# Altium schematic sheet schematic.SchDoc
size A4; SheetNumber: 6; SheetTotal: 29
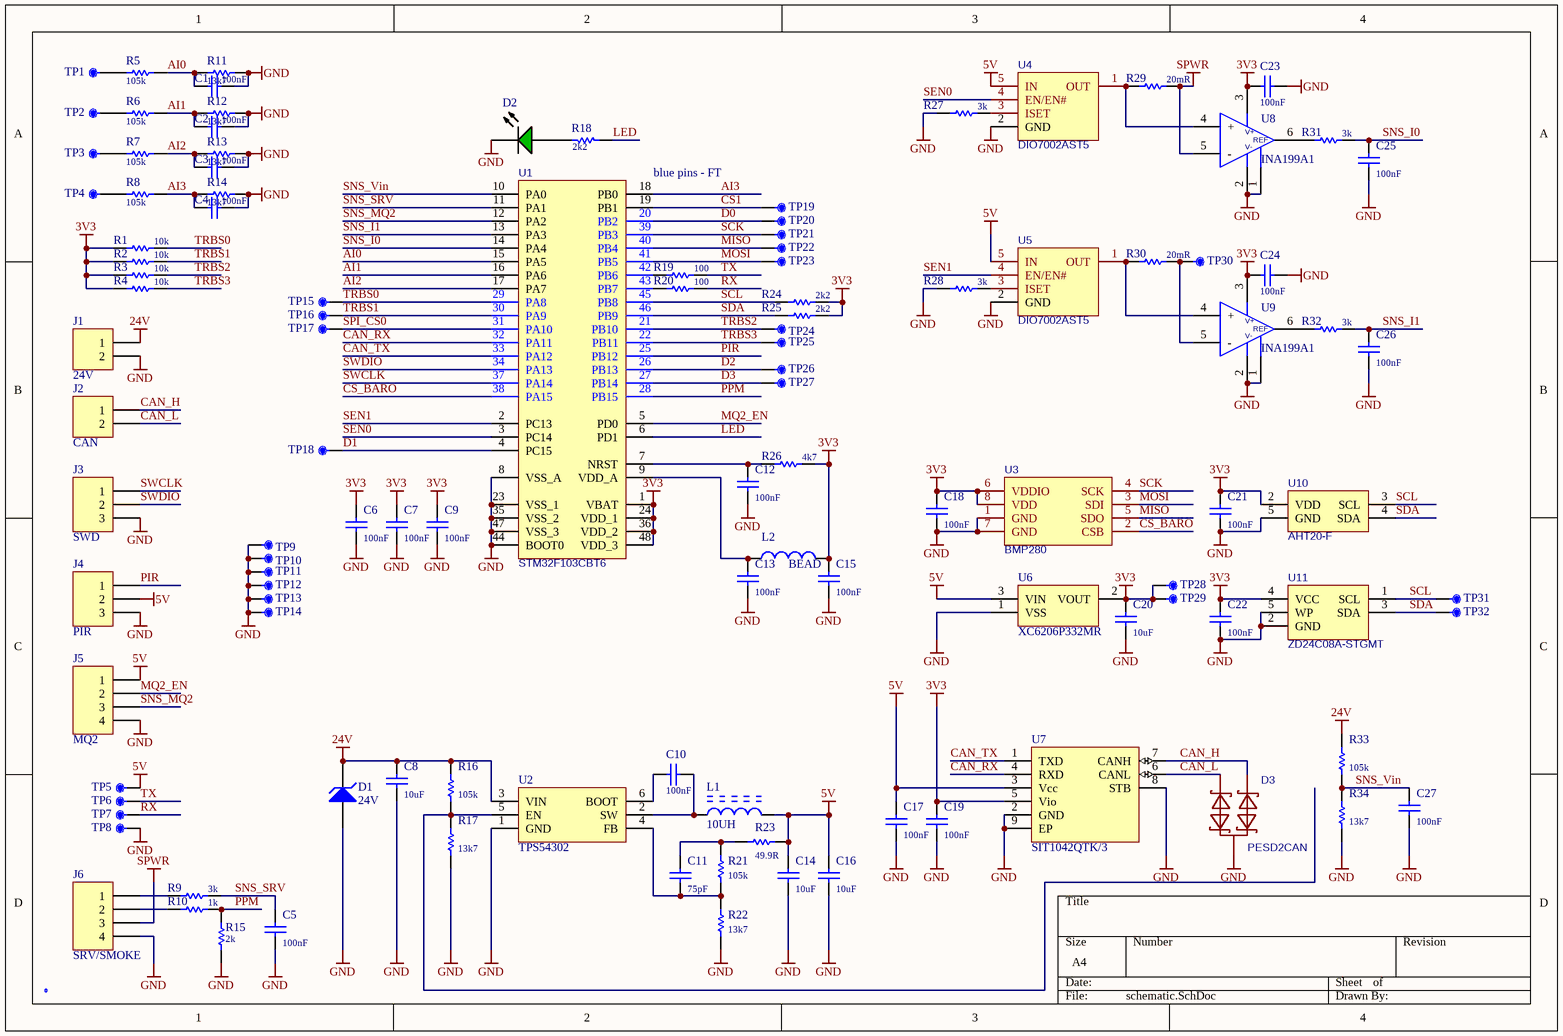
[diagram p0: schematic.SchDoc]

## Parts
C1  100nF  [C0402]
C2  100nF  [C0402]
C3  100nF  [C0402]
C4  100nF  [C0402]
C5  100nF  [C0402]
C6  100nF  [C0402]
C7  100nF  [C0402]
C8  10uF  [C1206]
C9  100nF  [C0402]
C10  100nF  [C0402]
C11  75pF  [C0402]
C12  100nF  [C0402]
C13  100nF  [C0402]
C14  10uF  [C1206]
C15  100nF  [C0402]
C16  10uF  [C1206]
C17  100nF  [C0402]
C18  100nF  [C0402]
C19  100nF  [C0402]
C20  10uF  [C1206]
C21  100nF  [C0402]
C22  100nF  [C0402]
C23  100nF  [C0402]
C24  100nF  [C0402]
C25  100nF  [C0402]
C26  100nF  [C0402]
C27  100nF  [C0402]
D1  24V  [SMB]
D2  GRN  [LED-0603-GRN]  (value not drawn)
D3  PESD2CAN  [SOT-23]
J1  24V  [CONN_DG308-2.54-2P]
J2  CAN  [CONN_DG308-2.54-2P]
J3  SWD  [SWD]  (no BOM)
J4  PIR  [CONN_MOLEX_532610371]  (no BOM)
J5  MQ2  [CONN_MOLEX_532610471]  (no BOM)
J6  SRV/SMOKE  [HDR-1X4]  (no BOM)
L1  10UH  [IND-SMD_L7.2-W6.6_GPSR07X0]
L2  BEAD  [L0402]
LOGO1  LOGO  [LOGO]  (value not drawn)  (no BOM)
R1  10k  [R0402]
R2  10k  [R0402]
R3  10k  [R0402]
R4  10k  [R0402]
R5  105k  [R0402]
R6  105k  [R0402]
R7  105k  [R0402]
R8  105k  [R0402]
R9  3k  [R0402]
R10  1k  [R0402]
R11  13k7  [R0402]
R12  13k7  [R0402]
R13  13k7  [R0402]
R14  13k7  [R0402]
R15  2k  [R0402]
R16  105k  [R0402]
R17  13k7  [R0402]
R18  2k2  [R0402]
R19  100  [R0402]
R20  100  [R0402]
R21  105k  [R0402]
R22  13k7  [R0402]
R23  49.9R  [R0402]
R24  2k2  [R0402]
R25  2k2  [R0402]
R26  4k7  [R0402]
R27  3k  [R0402]
R28  3k  [R0402]
R29  20mR  [R0805]
R30  20mR  [R0805]
R31  3k  [R0402]
R32  3k  [R0402]
R33  105k  [R0402]
R34  13k7  [R0402]
TP1  (no value)  [TP_TH_S0]  (no BOM)
TP2  (no value)  [TP_TH_S0]  (no BOM)
TP3  (no value)  [TP_TH_S0]  (no BOM)
TP4  (no value)  [TP_TH_S0]  (no BOM)
TP5  (no value)  [TP_TH_S0]  (no BOM)
TP6  (no value)  [TP_TH_S0]  (no BOM)
TP7  (no value)  [TP_TH_S0]  (no BOM)
TP8  (no value)  [TP_TH_S0]  (no BOM)
TP9  (no value)  [TP_TH_S0]  (no BOM)
TP10  (no value)  [TP_TH_S0]  (no BOM)
TP11  (no value)  [TP_TH_S0]  (no BOM)
TP12  (no value)  [TP_TH_S0]  (no BOM)
TP13  (no value)  [TP_TH_S0]  (no BOM)
TP14  (no value)  [TP_TH_S0]  (no BOM)
TP15  (no value)  [TP_TH_S0]  (no BOM)
TP16  (no value)  [TP_TH_S0]  (no BOM)
TP17  (no value)  [TP_TH_S0]  (no BOM)
TP18  (no value)  [TP_TH_S0]  (no BOM)
TP19  (no value)  [TP_TH_S0]  (no BOM)
TP20  (no value)  [TP_TH_S0]  (no BOM)
TP21  (no value)  [TP_TH_S0]  (no BOM)
TP22  (no value)  [TP_TH_S0]  (no BOM)
TP23  (no value)  [TP_TH_S0]  (no BOM)
TP24  (no value)  [TP_TH_S0]  (no BOM)
TP25  (no value)  [TP_TH_S0]  (no BOM)
TP26  (no value)  [TP_TH_S0]  (no BOM)
TP27  (no value)  [TP_TH_S0]  (no BOM)
TP28  (no value)  [TP_TH_S0]  (no BOM)
TP29  (no value)  [TP_TH_S0]  (no BOM)
TP30  (no value)  [TP_TH_S0]  (no BOM)
TP31  (no value)  [TP_TH_S0]  (no BOM)
TP32  (no value)  [TP_TH_S0]  (no BOM)
U1  STM32F103CBT6  [LQFP-48]
U2  TPS54302  [SOT-23-6]
U3  BMP280  [WLGA-8_L2.5-W2.0-P0.65-TR_DPS422]  (no BOM)
U4  DIO7002AST5  [SOT-23-5]
U5  DIO7002AST5  [SOT-23-5]
U6  XC6206P332MR  [SOT-23]
U7  SIT1042QTK/3  [DFN8_3X3_P065]
U8  INA199A1  [SOT-363]
U9  INA199A1  [SOT-363]  (no BOM)
U10  AHT20-F  [SENSOR-SMD_L3.0-W3.0-P1.00-BR]
U11  ZD24C08A-STGMT  [SOT-23-5]

## Nets
3V3: C6.2 C7.2 C9.2 C15.2 C18.2 C19.2 C20.2 C21.2 C22.2 C23.2 C24.2 L2.1 R1.2 R2.2 R3.2 R4.2 R24.2 R25.2 R26.1 TP28.1 TP29.1 U1.1(VBAT) U1.24(VDD_1) U1.36(VDD_2) U1.48(VDD_3) U3.6(VDDIO) U3.8(VDD) U6.2(VOUT) U7.5(Vio) U8.3(V+) U9.3(V+) U10.2(VDD) U11.4(VCC)
5V: C14.2 C16.2 C17.2 J4.2 J5.1 L1.2 R23.1 TP5.1 U4.5(IN) U5.5(IN) U6.3(VIN) U7.3(Vcc)
24V: C8.2 D1.2(K) J1.1 R16.1 R33.1 U2.3(VIN)
GND: C1.1 C2.1 C3.1 C4.1 C5.1 C6.1 C7.1 C8.1 C9.1 C12.1 C13.1 C14.1 C15.1 C16.1 C17.1 C18.1 C19.1 C20.1 C21.1 C22.1 C23.1 C24.1 C25.1 C26.1 C27.1 D1.1(A) D2.2(K) D3.3 J1.2 J3.3 J4.3 J5.4 J6.4 R11.2 R12.2 R13.2 R14.2 R15.2 R17.2 R22.2 R27.2 R28.2 R34.2 TP8.1 TP9.1 TP10.1 TP11.1 TP12.1 TP13.1 TP14.1 U1.8(VSS_A) U1.23(VSS_1) U1.35(VSS_2) U1.44(BOOT0) U1.47(VSS_3) U2.1(GND) U3.1(GND) U3.7(GND) U4.2(GND) U5.2(GND) U6.1(VSS) U7.2(GND) U7.8(STB) U7.9(EP) U8.1(REF) U8.2(GND) U9.1(REF) U9.2(GND) U10.5(GND) U11.2(GND) U11.5(WP)
SPWR: J6.3 R29.1 U8.5(-)
AI0: C1.2 R5.2 R11.1 U1.15(PA5)
AI1: C2.2 R6.2 R12.1 U1.16(PA6)
AI2: C3.2 R7.2 R13.1 U1.17(PA7)
AI3: C4.2 R8.2 R14.1 U1.18(PB0)
CAN_H: D3.2 J2.1 U7.7(CANH)
CAN_L: D3.1 J2.2 U7.6(CANL)
CAN_RX: U1.32(PA11) U7.4(RXD)
CAN_TX: U1.33(PA12) U7.1(TXD)
CS1: TP19.1 U1.19(PB1)
CS_BARO: U1.38(PA15) U3.2(CSB)
D0: TP20.1 U1.20(PB2)
D1: TP18.1 U1.4(PC15)
D2: TP26.1 U1.26(PB13)
D3: TP27.1 U1.27(PB14)
LED: R18.2 U1.6(PD1)
MISO: TP22.1 U1.40(PB4) U3.5(SDO)
MOSI: TP23.1 U1.41(PB5) U3.3(SDI)
MQ2_EN: J5.2 U1.5(PD0)
PIR: J4.1 U1.25(PB12)
PPM: R10.1 R15.1 U1.28(PB15)
RX: R20.1 TP7.1
SCK: TP21.1 U1.39(PB3) U3.4(SCK)
SCL: R24.1 TP31.1 U1.45(PB8) U10.3(SCL) U11.1(SCL)
SDA: R25.1 TP32.1 U1.46(PB9) U10.4(SDA) U11.3(SDA)
SEN0: U1.3(PC14) U4.4(EN/EN#)
SEN1: U1.2(PC13) U5.4(EN/EN#)
SNS_I0: C25.2 R31.1 U1.14(PA4)
SNS_I1: C26.2 R32.1 U1.13(PA3)
SNS_MQ2: J5.3 U1.12(PA2)
SNS_SRV: C5.2 R9.1 U1.11(PA1)
SNS_Vin: C27.2 R33.2 R34.1 U1.10(PA0)
SPI_CS0: TP17.1 U1.31(PA10)
SWCLK: J3.1 U1.37(PA14)
SWDIO: J3.2 U1.34(PA13)
TRBS0: R1.1 TP15.1 U1.29(PA8)
TRBS1: R2.1 TP16.1 U1.30(PA9)
TRBS2: R3.1 TP24.1 U1.21(PB10)
TRBS3: R4.1 TP25.1 U1.22(PB11)
TX: R19.1 TP6.1
NetC10_1: C10.1 U2.6(BOOT)
NetC10_2: C10.2 L1.1 U2.2(SW)
NetC11_1: C11.1 R21.2 R22.1 U2.4(FB)
NetC11_2: C11.2 R21.1 R23.2
NetC12_2: C12.2 R26.2 U1.7(NRST)
NetC13_2: C13.2 L2.2 U1.9(VDD_A)
NetD2_1: D2.1(A) R18.1
NetJ6_1: J6.1 R9.2
NetJ6_2: J6.2 R10.2
NetR5_1: R5.1 TP1.1
NetR6_1: R6.1 TP2.1
NetR7_1: R7.1 TP3.1
NetR8_1: R8.1 TP4.1
NetR16_2: R16.2 R17.1 U2.5(EN)
NetR19_2: R19.2 U1.42(PB6)
NetR20_2: R20.2 U1.43(PB7)
NetR27_1: R27.1 U4.3(ISET)
NetR28_1: R28.1 U5.3(ISET)
NetR29_2: R29.2 U4.1(OUT) U8.4(+)
NetR30_1: R30.1 TP30.1 U9.5(-)
NetR30_2: R30.2 U5.1(OUT) U9.4(+)
NetR31_2: R31.2 U8.6(OUT)
NetR32_2: R32.2 U9.6(OUT)

## Notes on the sheet
- blue pins - FT
- (in symbol MCP65R41T-2402) V-

## Library data of the parts
C1-C7 C9 C10 C12 C13 C15 C17-C19 C21-C27 = CAP: 100nF 50V 0402; P/N: 0402B104K500NT; LCSC part number: C110251
C8 C14 C16 C20 = CAP: 10uf 50V 1206; P/N: CL31B106KBHNNNE; LCSC part number: C89632
C11 = CAP: 75pF 50V 0402; P/N: CC0402JRNPO9BN750; LCSC part number: C107010
D1 = SMCJ54A: P6SMB24A; LCSC part number: C5155417; P/N: P6SMB24A
D2 = LED-0603-GREEN: LED 0603 GRN; P/N: SZYY0603YG; LCSC part number: C434423
D3 = CDSOT23-SM712: LCSC part number: C5261081; P/N: PESD2CAN
J1 J2 = CONN MOLEX HDR-M 1x4: DG308-2.54-02P-14-00A(H); LCSC part number: C699496; P/N: DG308-2.54-02P-14-00A(H)
J3-J6 = Header 3
L1 = SRN3015-100M: CYA0630-10UH; LCSC part number: C5189958; P/N: CYA0630-10UH
L2 = BLM18AG601SN1D: BEAD 0402; P/N: BLM15AG102SN1D; LCSC part number: C76883
R1-R4 = RES: 10k 0402; P/N: 0402WGF1002TCE; LCSC part number: C25744
R5-R8 R16 R21 R33 = RES: 105k 0402; P/N: WR04X1053FTL; LCSC part number: C170210
R9 R27 R28 = R0201: 3k 0402; P/N: 0402WGF3001TCE; LCSC part number: C25784
R10 = RES: 1k 0402; P/N: 0402WGF1001TCE; LCSC part number: C11702
R11-R14 R17 R22 R34 = RES: 13k7 0402; P/N: FRC0402F1372TS; LCSC part number: C2933072
R15 R18 R24 R25 = RES: 2k 0402; P/N: 0402WGF2001TCE; LCSC part number: C4109
R19 R20 = RES: 100 0402; P/N: 0402WGF1000TCE; LCSC part number: C25076
R23 = R0201: 49R9 0402; P/N: RC0402FR-0749R9L; LCSC part number: C87044
R26 = RES: 4k7 0402; P/N: 0402WGF4701TCE; LCSC part number: C25900
R29 R30 = R0201: 0805W4F200MT5E; P/N: FRL0805JR020TS; LCSC part number: C7467520
R31 R32 = RES: 3k 0402; P/N: 0402WGF3001TCE; LCSC part number: C25784
TP1-TP32 = TP_Dup1
U2 = LM27313XMFX: TPS54302DDCR; LCSC part number: C311983; P/N: TPS54302
U6 = Component_4_1: LCSC part number: C5148692; P/N: XC6206P332MR
U7 = LTC2875: IC INTERFACE CAN; LCSC part number: C5308062; P/N: SIT1042QTK/3
U8 U9 = MCP65R41T-2402: P/N: INA199A1DCKR; LCSC part number: C59135
U10 = AHT21: AHT20-F | HDC1080DMBR | AHT21; LCSC part number: C3012622; P/N: AHT20-F
U1 = STM32F103CBT6: LCSC part number: C8304; P/N: STM32F103CBT6
U3 = BMP280: LCSC part number: C83291; P/N: BMP280
U4 U5 = DIO7002AST5: LCSC part number: C403840; P/N: DIO7002AST5
U11 = ZD24C08A-STGMT: LCSC part number: C2896640; P/N: ZD24C08A-STGMT